# EAGLE design Callisto_Rj45_Breakout (EAGLE 9.6.2)
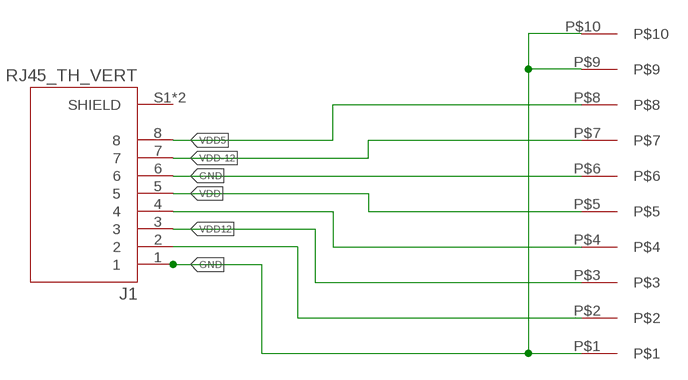
[diagram p0: schematic, sheet 1]

## Parts
J1  RJ45_TH_VERT  [ASSMANN_A-2014-2S-4-N-R]
U$1  1_X_10_HEADER_GENERIC_.1INCH  [HEADER_1_X_10_.1_INCH]

## Nets
GND: J1.1 J1.6 U$1.P$1 U$1.P$6 U$1.P$9 U$1.P$10
IO_SIGNAL: J1.2 U$1.P$2
N$1: J1.4 U$1.P$4
VDD: J1.5 U$1.P$5
VDD5: J1.8 U$1.P$8
VDD12: J1.3 U$1.P$3
VDD-12: J1.7 U$1.P$7
Unconnected: J1.S1(SHIELD) J1.S2(SHIELD)

## Library data of the parts
J1 = 3D_MIG_Controller:RJ45_TH_VERT: Jack Modular Connector 8p8c (RJ45, Ethernet) Vertical Shielded; DESCRIPTION: Jack Modular Connector 8p8c (RJ45, Ethernet) Vertical Shielded; DIGI-KEY_PART_NUMBER: AE10399-ND; MF: Assmann WSW Components; MP: A-2014-2S-4-N-R; PACKAGE: None
U$1 = 3D_MIG_Controller:1_X_10_HEADER_GENERIC_.1INCH

## Board
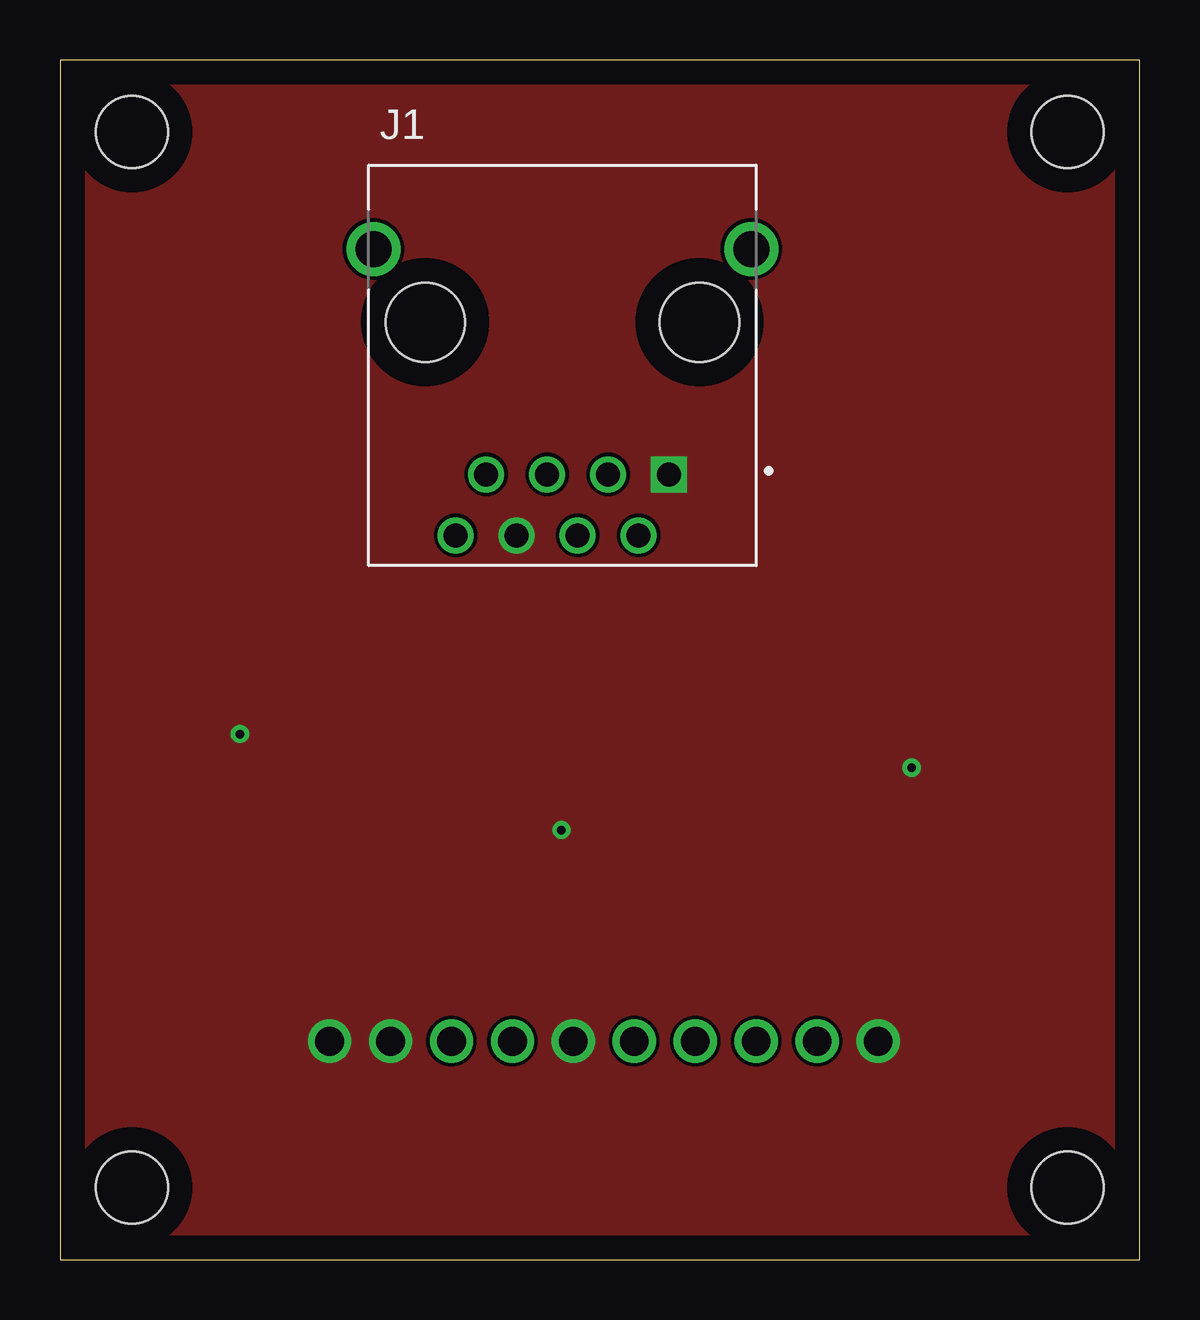
[diagram p1: board, top side]
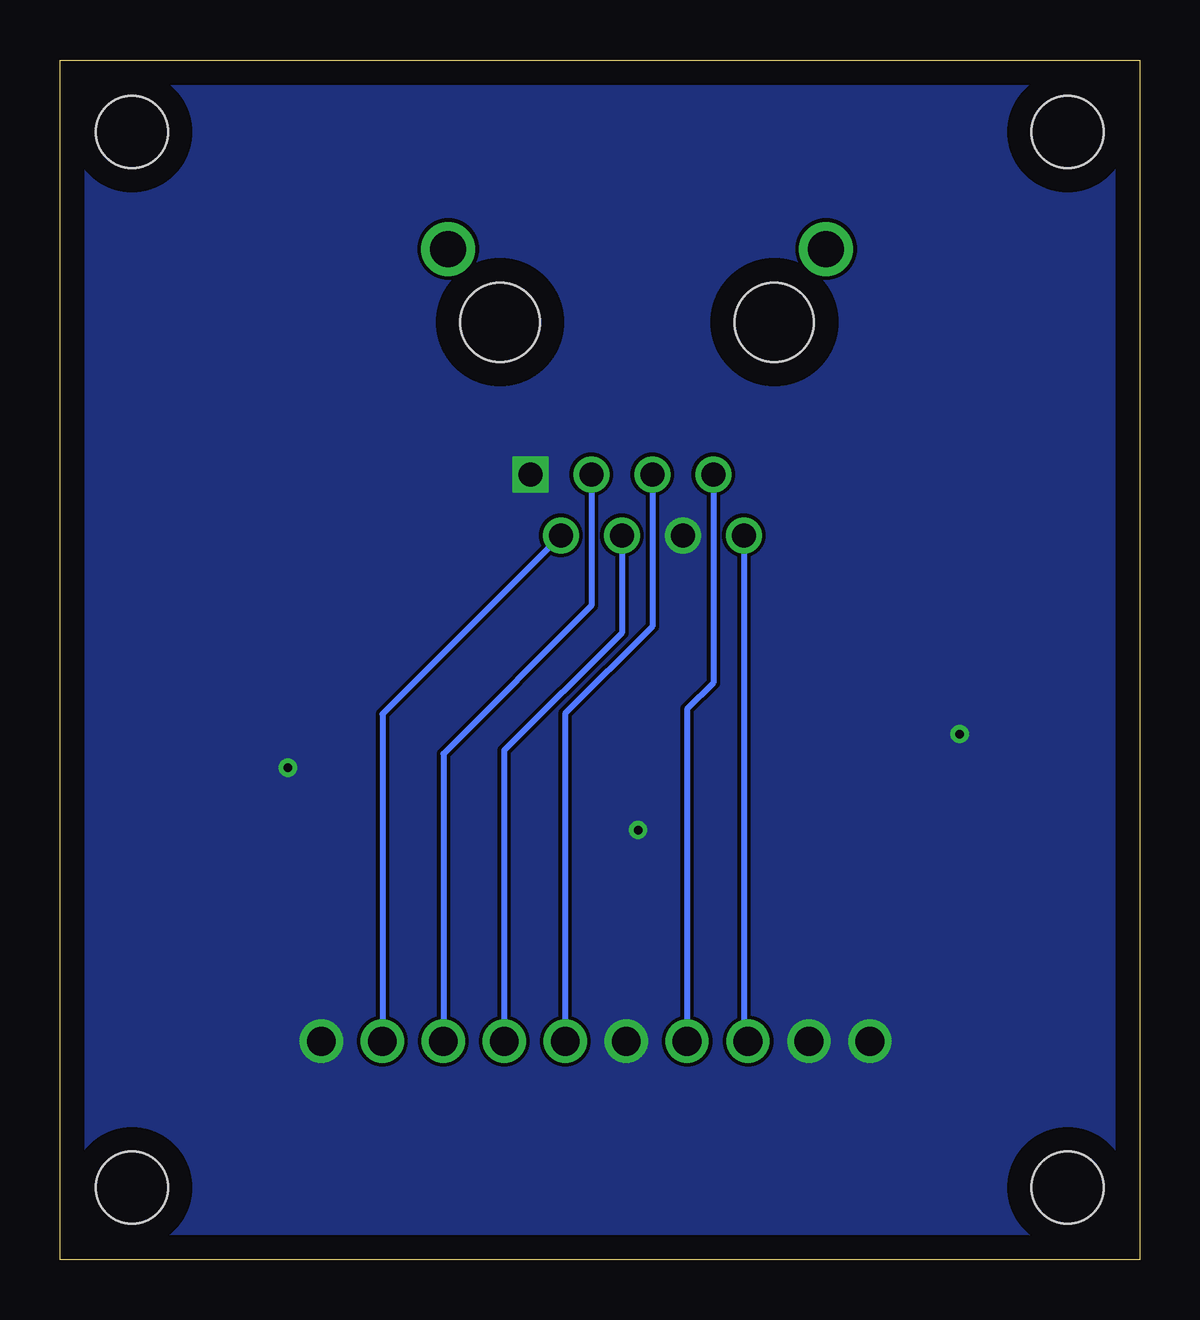
[diagram p2: board, bottom side, seen from below]

Size 45 x 50 mm. Coordinates in mm from the lower left corner, seen from the top.
Outline: 0,0 45,0 45,50 0,50 0,0
Copper layers (1*16): Top 0.035mm / dielectric 1.5mm / Bottom 0.035mm
Design rules "default": minimum track width 6mil, minimum drill 0.35mm, track to track 6mil, track to pad 6mil, pad to pad 6mil, via to via 6mil, smd to smd 6mil, copper to edge 40mil, drill to drill 6mil, minimum pad ring 10mil, minimum via ring 8mil, stop-mask expansion 4mil, vias tented up to drill 0mil, thermal gap 10mil
Holes 3 mm at 3,3 42,3 3,47 42,47

### Footprints (pad centres in the part's own frame; a part is rotated, then mirrored left to right if it is on the bottom)
ASSMANN_A-2014-2S-4-N-R = drill 1 square: 1 4.445,-6.35 | drill 1: 2 3.175,-8.89; 3 1.905,-6.35; 4 0.635,-8.89; 5 -0.635,-6.35; 6 -1.905,-8.89; 7 -3.175,-6.35; 8 -4.445,-8.89 | drill 1.5: S1 -7.875,3.05; S2 7.875,3.05 | hole 3.3: -5.715,0; 5.715,0
HEADER_1_X_10_.1_INCH = drill 1.2 pad 1.6: P$1 -24.13,-1.27; P$2 -21.59,-1.27; P$3 -19.05,-1.27; P$4 -16.51,-1.27; P$5 -13.97,-1.27; P$6 -11.43,-1.27; P$7 -8.89,-1.27; P$8 -6.35,-1.27; P$9 -3.81,-1.27; P$10 -1.27,-1.27

### Placement (x,y rotation side)
J1  20.94,39.07 0 top
U$1  9.97,7.83 180 top

### Tracks (layer width: path | path; a pad name or v marks a point on that pad's centre or on a via)
GND  (via drill 0.35)
  other vias: 7.5,21.9 20.9,17.9 35.5,20.5
  pour Bottom (no thermals): 0,50 45,50 45,0 0,0
  pour Top (no thermals): 0,50 45,50 45,0 0,0
IO_SIGNAL
  Bottom 0.254: J1.2 31.56,22.73 U$1.P$2
N$1
  Bottom 0.254: J1.4 21.57,26.12 26.48,21.22 U$1.P$4
VDD
  Bottom 0.254: J1.5 20.3,26.39 23.94,22.76 U$1.P$5
VDD5
  Bottom 0.254: J1.8 16.5,9.28 U$1.P$8
VDD12
  Bottom 0.254: J1.3 22.84,27.25 29.02,21.08 U$1.P$3
VDD-12
  Bottom 0.254: J1.7 17.77,24.04 18.86,22.94 U$1.P$7